# EAGLE design base_acacia (EAGLE 7.7.0)
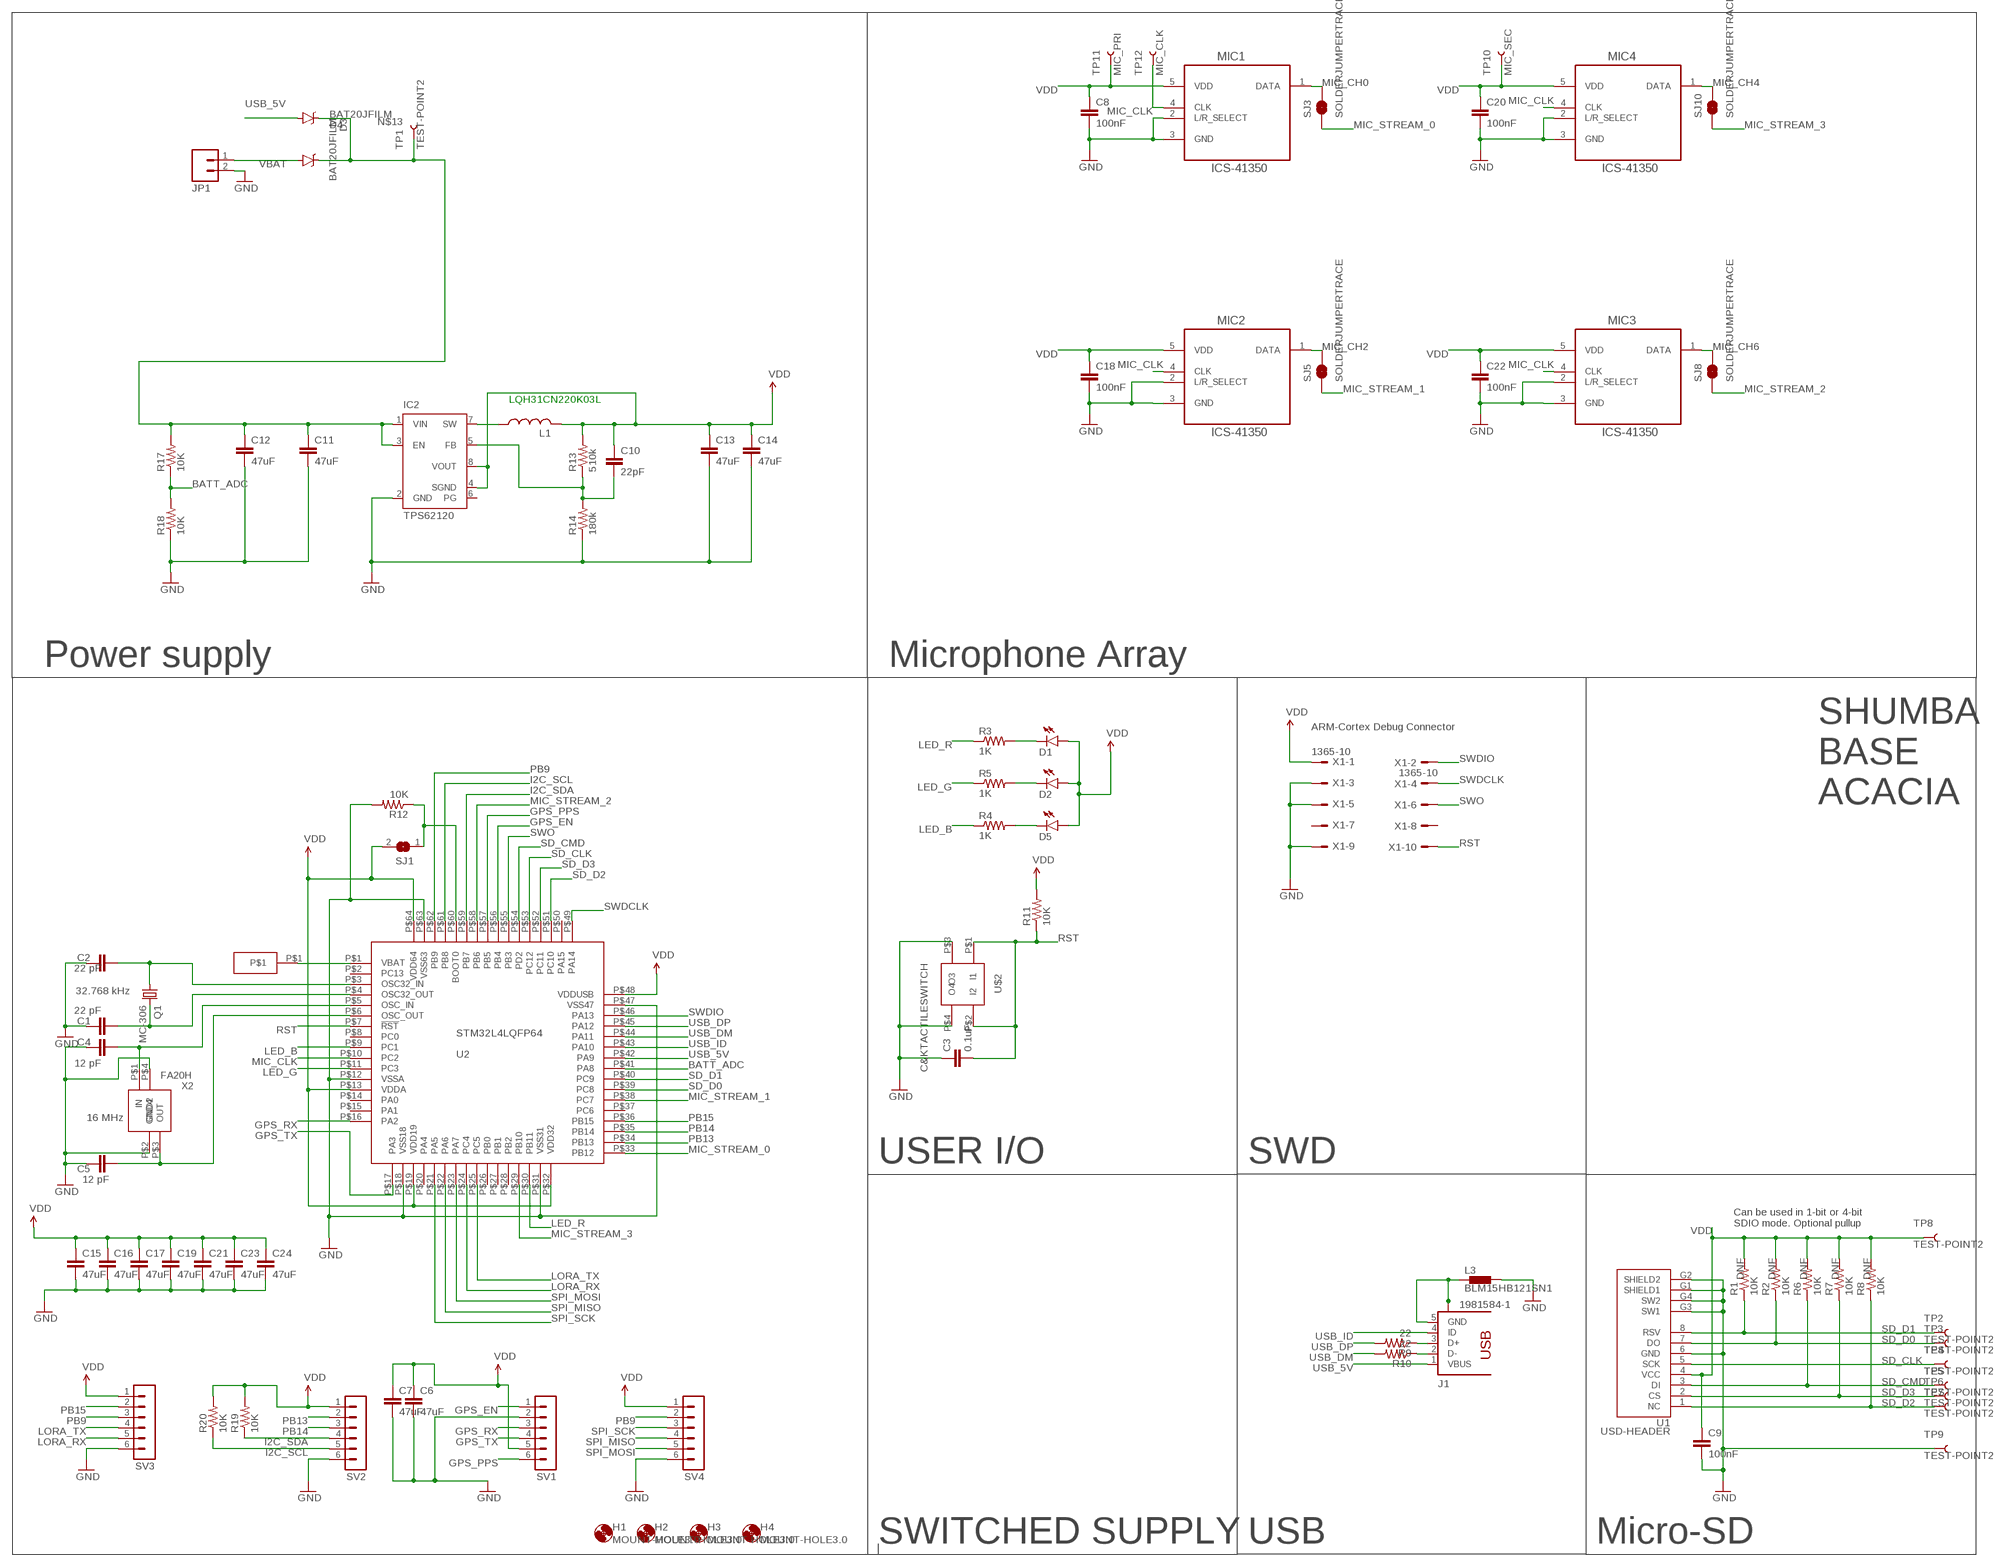
[diagram p0: schematic, sheet 1]

## Parts
C1  22 pF  CAP0603-CAP  [0603-CAP]
C2  22 pF  CAP0603-CAP  [0603-CAP]
C3  0.1uF  0.1UF-25V(+80/-20%)(0603)  [0603-CAP]
C4  12 pF  CAP0603-CAP  [0603-CAP]
C5  12 pF  CAP0603-CAP  [0603-CAP]
C6  47uF  CAP0603-CAP  [0603-CAP]
C7  47uF  CAP0603-CAP  [0603-CAP]
C8  100nF  CAP0603-CAP  [0603-CAP]
C9  100nF  CAP0603-CAP  [0603-CAP]
C10  22pF  CAP0603-CAP  [0603-CAP]
C11  47uF  CAP0603-CAP  [0603-CAP]
C12  47uF  CAP0603-CAP  [0603-CAP]
C13  47uF  CAP0603-CAP  [0603-CAP]
C14  47uF  CAP0603-CAP  [0603-CAP]
C15  47uF  CAP0603-CAP  [0603-CAP]
C16  47uF  CAP0603-CAP  [0603-CAP]
C17  47uF  CAP0603-CAP  [0603-CAP]
C18  100nF  CAP0603-CAP  [0603-CAP]
C19  47uF  CAP0603-CAP  [0603-CAP]
C20  100nF  CAP0603-CAP  [0603-CAP]
C21  47uF  CAP0603-CAP  [0603-CAP]
C22  100nF  CAP0603-CAP  [0603-CAP]
C23  47uF  CAP0603-CAP  [0603-CAP]
C24  47uF  CAP0603-CAP  [0603-CAP]
D1  LED0603  [LED-0603]
D2  LED0603  [LED-0603]
D3  BAT20JFILM  [SOD-323]
D4  BAT20JFILM  [SOD-323]
D5  LED0603  [LED-0603]
H1  MOUNT-HOLE3.0  [3,0]
H2  MOUNT-HOLE3.0  [3,0]
H3  MOUNT-HOLE3.0  [3,0]
H4  MOUNT-HOLE3.0  [3,0]
IC2  TPS62120  [DCN-R-PDSO-G8]
J1  1981584-1  [1981584-1]
JP1  M02PTH4  [1X02_XTRA_BIG]
L1  L-USL3216C  [L3216C]
L3  BLM15HB121SN1  [0402]
MIC1  ICS-41350  [ADI_ADMP521A]
MIC2  ICS-41350  [ADI_ADMP521A]
MIC3  ICS-41350  [ADI_ADMP521A]
MIC4  ICS-41350  [ADI_ADMP521A]
Q1  MC-306  [MC-306]
R1  10K  10KOHM-1/10W-1%(0603)0603  [0603-RES]
R2  10K  10KOHM-1/10W-1%(0603)0603  [0603-RES]
R3  1K  1KOHM-1/10W-1%(0603)  [0603-RES]
R4  1K  1KOHM-1/10W-1%(0603)  [0603-RES]
R5  1K  1KOHM-1/10W-1%(0603)  [0603-RES]
R6  10K  10KOHM-1/10W-1%(0603)0603  [0603-RES]
R7  10K  10KOHM-1/10W-1%(0603)0603  [0603-RES]
R8  10K  10KOHM-1/10W-1%(0603)0603  [0603-RES]
R9  22  10KOHM-1/10W-1%(0603)0603  [0603-RES]
R10  22  10KOHM-1/10W-1%(0603)0603  [0603-RES]
R11  10K  10KOHM-1/10W-1%(0603)0603  [0603-RES]
R12  10K  10KOHM-1/10W-1%(0603)0603  [0603-RES]
R13  510k  10KOHM-1/10W-1%(0603)0603  [0603-RES]
R14  180k  10KOHM-1/10W-1%(0603)0603  [0603-RES]
R17  10K  10KOHM-1/10W-1%(0603)0603  [0603-RES]
R18  10K  10KOHM-1/10W-1%(0603)0603  [0603-RES]
R19  10K  10KOHM-1/10W-1%(0603)0603  [0603-RES]
R20  10K  10KOHM-1/10W-1%(0603)0603  [0603-RES]
SJ1  SJ  [SJ]
SJ3  SOLDERJUMPERTRACE  [SJ_2S-TRACE]
SJ5  SOLDERJUMPERTRACE  [SJ_2S-TRACE]
SJ8  SOLDERJUMPERTRACE  [SJ_2S-TRACE]
SJ10  SOLDERJUMPERTRACE  [SJ_2S-TRACE]
SV1  MA06-1  [MA06-1]
SV2  MA06-1  [MA06-1]
SV3  MA06-1  [MA06-1]
SV4  MA06-1  [MA06-1]
TP1  TEST-POINT2  [PAD.02X.02]
TP2  TEST-POINT2  [PAD.02X.02]
TP3  TEST-POINT2  [PAD.02X.02]
TP4  TEST-POINT2  [PAD.02X.02]
TP5  TEST-POINT2  [PAD.02X.02]
TP6  TEST-POINT2  [PAD.02X.02]
TP7  TEST-POINT2  [PAD.02X.02]
TP8  TEST-POINT2  [PAD.02X.02]
TP9  TEST-POINT2  [PAD.02X.02]
TP10  MIC_SEC  TEST-POINT2  [PAD.02X.02]
TP11  MIC_PRI  TEST-POINT2  [PAD.02X.02]
TP12  MIC_CLK  TEST-POINT2  [PAD.02X.02]
U1  USD-HEADER  [USD-HEADER-1.1]
U2  STM32L4LQFP64  [STM32L4LQFP64]
U$2  C&KTACTILESWITCH  [C&KTACTILESWITCH]
U$7  SMDPAD  [SMDPAD]
X1  1365-10  [1365-10]
X2  FA20H  [FA-20H]

## Nets
BATT_ADC: R17.1 R18.2 U2.P$41(PA8)
GND: C1.1 C2.1 C3.1 C4.1 C5.1 C6.2 C7.2 C8.2 C9.2 C11.2 C12.2 C13.2 C14.2 C15.2 C16.2 C17.2 C18.2 C19.2 C20.2 C21.2 C22.2 C23.2 C24.2 IC2.2(GND) JP1.2 L3.2 MIC1.2(L/R_SELECT) MIC1.3(GND) MIC2.2(L/R_SELECT) MIC2.3(GND) MIC3.2(L/R_SELECT) MIC3.3(GND) MIC4.2(L/R_SELECT) MIC4.3(GND) R12.2 R14.1 R18.1 SV1.2 SV2.6 SV3.6 SV4.6 TP9.P$1 U1.6(GND) U1.G1(SHIELD1) U1.G2(SHIELD2) U1.G3(SW1) U1.G4(SW2) U2.P$12(VSSA) U2.P$18(VSS18) U2.P$31(VSS31) U2.P$47(VSS47) U2.P$63(VSS63) U$2.P$3(O3) U$2.P$4(O4) X1.3 X1.5 X1.9 X2.P$2(GND2) X2.P$4(GND4)
GPS_EN: SV1.1 U2.P$56(PB4)
GPS_PPS: SV1.6 U2.P$57(PB5)
GPS_RX: SV1.3 U2.P$16(PA2)
GPS_TX: SV1.4 U2.P$17(PA3)
I2C_SCL: R20.1 SV2.5 U2.P$61(PB8)
I2C_SDA: R19.1 SV2.4 U2.P$59(PB7)
LED_B: R4.1 U2.P$9(PC1)
LED_G: R5.1 U2.P$11(PC3)
LED_R: R3.1 U2.P$30(PB11)
LORA_RX: SV3.5 U2.P$24(PC4)
LORA_TX: SV3.4 U2.P$25(PC5)
MIC_CH0: MIC1.1(DATA) SJ3.2
MIC_CH2: MIC2.1(DATA) SJ5.2
MIC_CH4: MIC4.1(DATA) SJ10.2
MIC_CH6: MIC3.1(DATA) SJ8.2
MIC_CLK: MIC1.4(CLK) MIC2.4(CLK) MIC3.4(CLK) MIC4.4(CLK) TP12.P$1 U2.P$10(PC2)
MIC_STREAM_0: SJ3.1 U2.P$33(PB12)
MIC_STREAM_1: SJ5.1 U2.P$38(PC7)
MIC_STREAM_2: SJ8.1 U2.P$58(PB6)
MIC_STREAM_3: SJ10.1 U2.P$29(PB10)
N$1: C2.2 Q1.1 U2.P$3(OSC32_IN)
N$2: C1.2 Q1.4 U2.P$4(OSC32_OUT)
N$3: C4.2 U2.P$5(OSC_IN) X2.P$1(IN)
N$4: C5.2 U2.P$6(OSC_OUT) X2.P$3(OUT)
N$6: J1.3(D+) R9.1
N$7: R12.1 SJ1.1 U2.P$60(BOOT0)
N$8: J1.2(D-) R10.1
N$9: U2.P$1(VBAT) U$7.P$1
N$11: D1.C R3.2
N$12: D2.C R5.2
N$13 [power]: C11.1 C12.1 D3.C D4.C IC2.1(VIN) IC2.3(EN) R17.2 TP1.P$1
N$17: D5.C R4.2
N$18 [power]: IC2.7(SW) L1.1
N$21: C10.2 IC2.5(FB) R13.1 R14.2
PB9: SV3.3 SV4.2 U2.P$62(PB9)
PB13: SV2.2 U2.P$34(PB13)
PB14: SV2.3 U2.P$35(PB14)
PB15: SV3.2 U2.P$36(PB15)
RST: C3.2 R11.1 U2.P$7(!RST) U$2.P$1(I1) U$2.P$2(I2) X1.10
SD_CLK: TP4.P$1 U1.5(SCK) U2.P$53(PC12)
SD_CMD: R6.1 TP5.P$1 U1.3(DI) U2.P$54(PD2)
SD_D0: R2.1 TP3.P$1 U1.7(DO) U2.P$39(PC8)
SD_D1: R1.1 TP2.P$1 U1.8(RSV) U2.P$40(PC9)
SD_D2: R8.1 TP7.P$1 U1.1(NC) U2.P$51(PC10)
SD_D3: R7.1 TP6.P$1 U1.2(CS) U2.P$52(PC11)
SPI_MISO: SV4.4 U2.P$22(PA6)
SPI_MOSI: SV4.5 U2.P$23(PA7)
SPI_SCK: SV4.3 U2.P$21(PA5)
SWDCLK: U2.P$49(PA14) X1.4
SWDIO: U2.P$46(PA13) X1.2
SWO: U2.P$55(PB3) X1.6
USB_5V: D4.A J1.1(VBUS) U2.P$42(PA9)
USB_DM: R10.2 U2.P$44(PA11)
USB_DP: R9.2 U2.P$45(PA12)
USB_ID: J1.4(ID) U2.P$43(PA10)
USB_SHIELD: J1.5(GND) J1.S1 J1.S2 J1.S3 J1.S4 L3.1
VBAT [power]: D3.A JP1.1
VDD: C6.1 C7.1 C8.1 C9.1 C10.1 C13.1 C14.1 C15.1 C16.1 C17.1 C18.1 C19.1 C20.1 C21.1 C22.1 C23.1 C24.1 D1.A D2.A D5.A IC2.4(SGND) IC2.8(VOUT) L1.2 MIC1.5(VDD) MIC2.5(VDD) MIC3.5(VDD) MIC4.5(VDD) R1.2 R2.2 R6.2 R7.2 R8.2 R11.2 R13.2 R19.2 R20.2 SJ1.2 SV1.5 SV2.1 SV3.1 SV4.1 TP8.P$1 TP10.P$1 TP11.P$1 U1.4(VCC) U2.P$13(VDDA) U2.P$19(VDD19) U2.P$32(VDD32) U2.P$48(VDDUSB) U2.P$64(VDD64) X1.1
Unconnected: IC2.6(PG) U2.P$2(PC13) U2.P$8(PC0) U2.P$14(PA0) U2.P$15(PA1) U2.P$20(PA4) U2.P$26(PB0) U2.P$27(PB1) U2.P$28(PB2) U2.P$37(PC6) U2.P$50(PA15) X1.7 X1.8

## Notes on the sheet
- LQH31CN220K03L
- Power supply | Microphone Array
- ARM-Cortex Debug Connector
- SHUMBA
  BASE
  ACACIA
- 32.768 kHz
- 16 MHz
- USER I/O | SWD
- Can be used in 1-bit or 4-bit
  SDIO mode. Optional pullup
- SWITCHED SUPPLY | USB | Micro-SD

## Library data of the parts
C1 C2 C4 C5 = SparkFun-Capacitors:CAP: Capacitor Standard 0603 ceramic capacitor, and 0.1" leaded capacitor.
C3 = SparkFun-Capacitors:0.1UF-25V(+80/-20%)(0603): CAP-00810 Ceramic Standard decoupling cap; PROD_ID: CAP-00810
C6-C24 = SparkFun-Passives:CAP: Capacitor Standard 0603 ceramic capacitor, and 0.1" leaded capacitor.
D1 D2 D5 = SparkFun-LED:LED: LEDs Standard schematic elements and footprints for 5mm, 3mm, 1206, and 0603 sized LEDs. 5mm - Spark Fun Electronics SKU : COM-00529 (and others)
D3 D4 = SparkFun-DiscreteSemi:BAT20JFILM: 23V, 1A Schottky diode, SOD-323 package; PROD_ID: DIO-11623
H1-H4 = holes:MOUNT-HOLE: MOUNTING HOLE with drill center marker
IC2 = texas:TPS62120: 15V, 75mA High Efficient Buck Converter Source: tps62120.pdf (www.ti.com); OC_DIGIKEY: 296-27815-1-ND; OC_FARNELL: 2345836
J1 = con-usb:1981584-1: Receptacle, micro-USB, type A/B Tyco Electronics; MF: Hirose; MPN: ZX 62 B 5PA(33); OC_DIGIKEY: H125270CT-ND
JP1 = SparkFun-Connectors:M02: Standard 2-pin 0.1" header. Use with - straight break away headers ( PRT-00116) - right angle break away headers (PRT-00553) - swiss pins (PRT-00743) - machine pins (PRT-00117) - female headers (PRT-00115) Molex polarized connector foot print use with: PRT-08233 with associated crimp pins and housings. 2.54_SCREWTERM for use with PRT-10571. 3.5mm Screw Terminal footprints for PRT-08084 5mm Screw Terminal footprints for use with PRT-08432; OC_FARNELL: 9731148
L1 = rcl:L-US: INDUCTOR, American symbol
L3 = inductors:BLM15H: EMIFIL (R) Chip Ferrite Bead for GHz Noise Source: http://www.murata.com/ Ferrite Bead BLM15H.pdf
MIC1-MIC4 = MEMS_MIC:ICS-41350: Invense ICS-41350 PDM MIC LGA_CAV5 package
Q1 = crystal:MC-306: kHz RANGE CRYSTAL UNIT SMD Source: MC-306_405_406_E07X.PDF Homepage <http://www.epsontoyocom.co.jp>; MPN: MC-306 32.768KHZ 20PPM ,12.5PF; OC_FARNELL: 1216208
R1 R2 R6-R8 = SparkFun-Resistors:10KOHM-1/10W-1%(0603): RES-00824; DNF: DNF; PROD_ID: RES-00824
R3-R5 = SparkFun-Resistors:1KOHM-1/10W-1%(0603): RES-07856; PROD_ID: RES-07856
R9 R10 R13 R14 = SparkFun-Resistors:10KOHM-1/10W-1%(0603): RES-00824; PROD_ID: RES-00824; VALUE: 10K
R11 R12 R17-R20 = SparkFun-Resistors:10KOHM-1/10W-1%(0603): RES-00824; PROD_ID: RES-00824
SJ1 = jumper:SJ: SMD solder JUMPER
SJ3 SJ5 SJ8 SJ10 = SparkFun-Retired:SOLDERJUMPER: Solder Jumper Standard SMD solder jumper. Used to automate production. Two varients : Normally Open and Normally Closed are the same, but have different paste layers. NC will have a large amount of paste and should jumper during reflow.
SV1-SV4 = con-lstb:MA06-1: PIN HEADER; OC_FARNELL: unknown; OC_NEWARK: unknown
TP1-TP12 = SparkFun-Passives:TEST-POINT: Bare copper test points for troubleshooting or ICT
U1 = ACM:USD-HEADER: microSD Header MOLEX CONNECTOR, MICRO SD HEADER, 2.65MM Connector Type:Memory Card; Series:47309; No. of Contacts:8; Pitch Spacing 1.1 mm Farnell order code: 1568092 Comes in different heights
U2 = Kris:STM32L4LQFP64: LQFP64 Package for ST's STM32L476 32-bit low-power microcontroller
U$2 = Kris:C&KTACTILESWITCH: C&K Tactile Switch 611-PTS810SJS250SMTR
U$7 = Kris:SMDPAD: smd test pad
X1 = con-leotronics:1365-10: DUAL ROW STRAIGHT HEADER 1364 SERIES. 1.27mm x 1.27mm. Without Fixing Post. SMT Source: http://www.leotronics.co.uk/Conexcon/Data%20Sheets/sec.%20A/1364ing.pdf; OC_FARNELL: unknown; OC_NEWARK: unknown; SKU: SHF-105-01-L-D-SM
X2 = Kris:FA20H: Seiko Epson 2.5 mm x 2.0 mm FA-20H 16 MHz crystal; MPN: Q24FA20H00044 FA-20H 16 MHZ 9.0PF Crystal, 16 MHz, SMD; OC_DIGIKEY: SER4068CT-ND; OC_FARNELL: 1712814

## Net classes
0 default: width 0.254 mm, clearance 0.203 mm
1 power: width 0.254 mm, clearance 0.203 mm

## Board
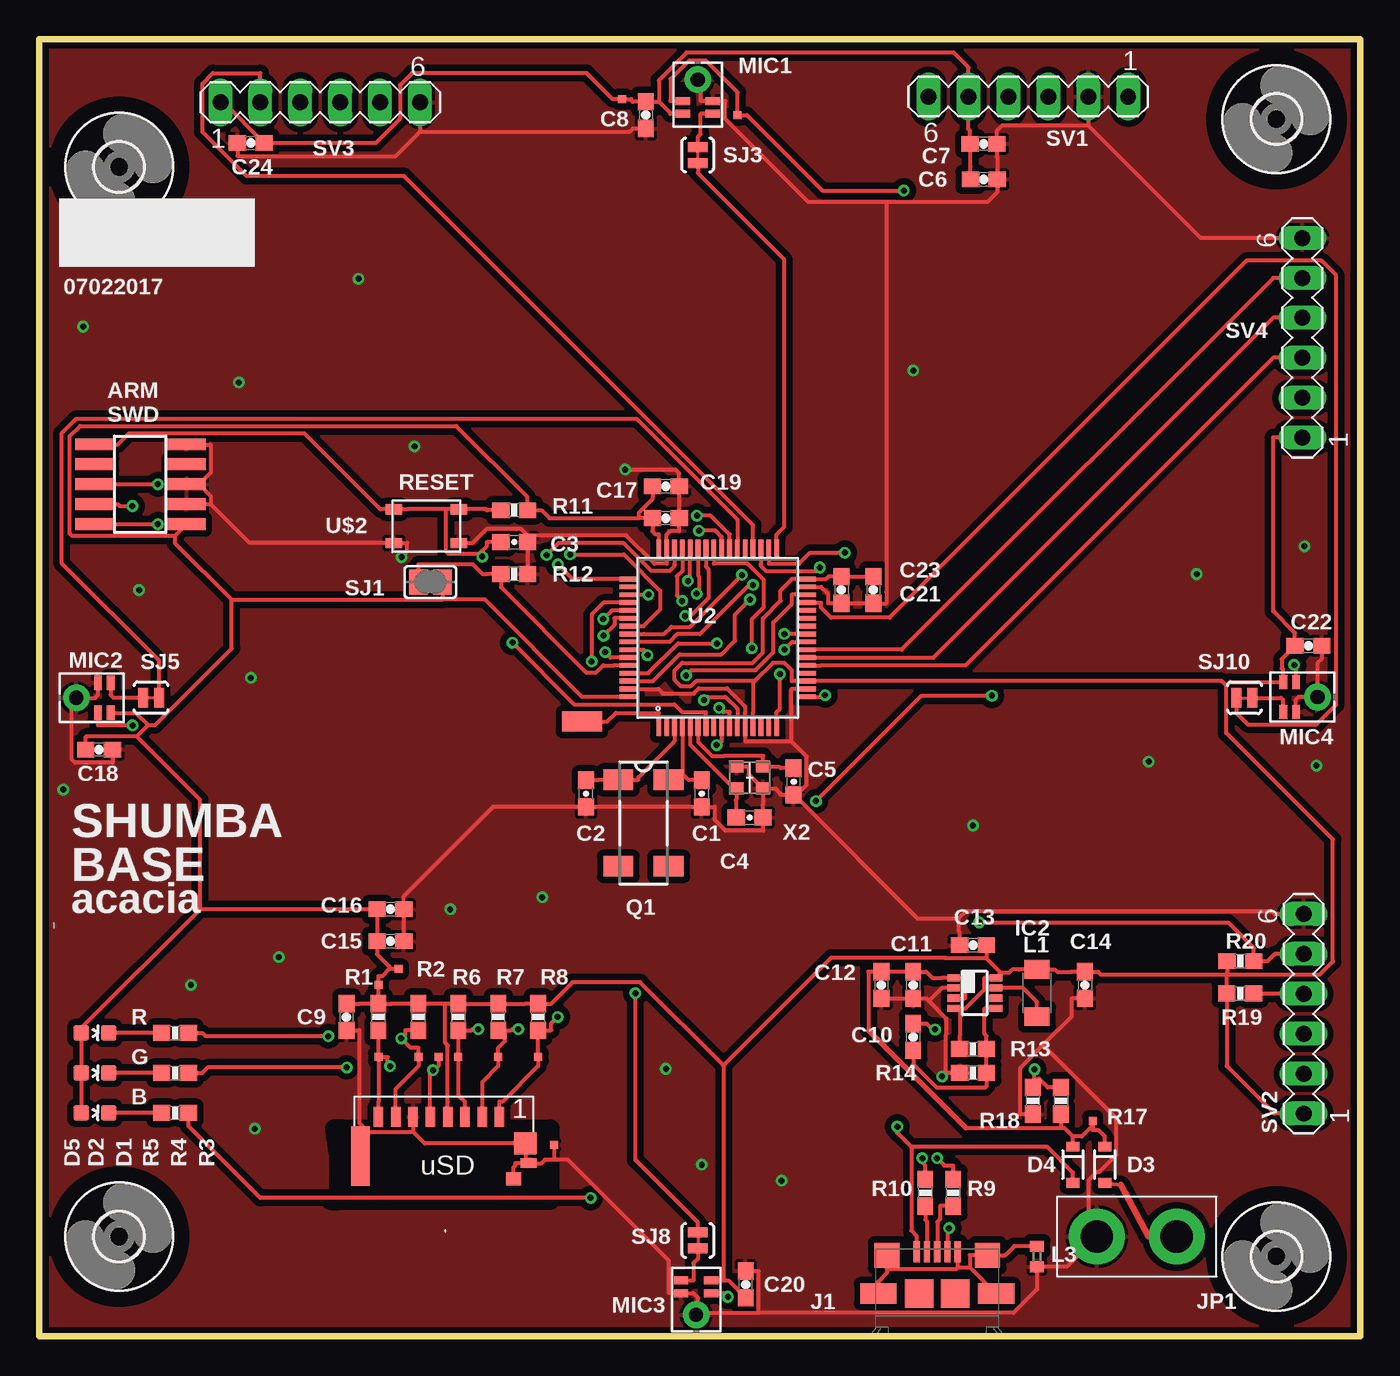
[diagram p1: board, top side]
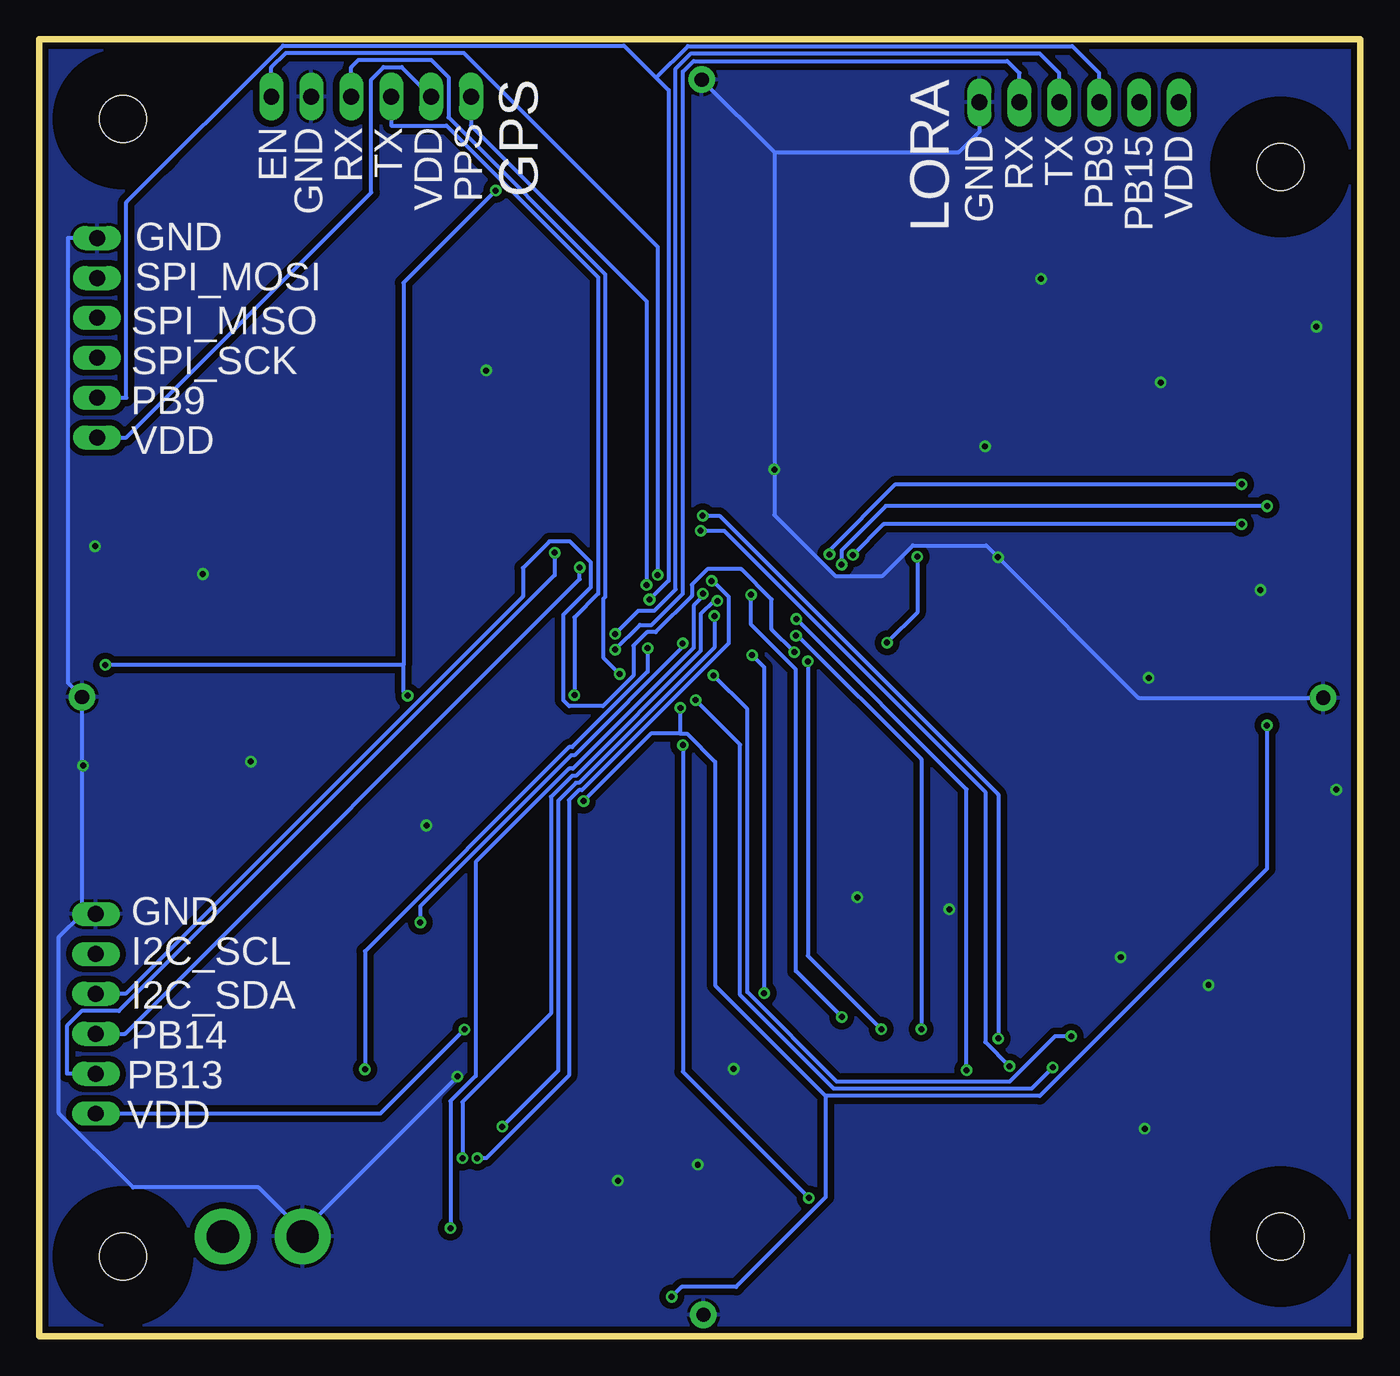
[diagram p2: board, bottom side, seen from below]

Size 84.07 x 82.55 mm. Coordinates in mm from the lower left corner, seen from the top.
Outline: 0,0 84.07,0 84.07,82.55 0,82.55 0,0
Copper layers (1*16): Top 0.018mm / dielectric 1.55mm / Bottom 0.018mm
Design rules "eC_2Layer_PClass6_BaseCopperO18_eCDefault": minimum track width 0.15mm, minimum drill 0.35mm, track to track 0.15mm, track to pad 0.15mm, pad to pad 0.15mm, via to via 0.15mm, smd to smd 0mil, copper to edge 0.25mm, drill to drill 0.35mm, minimum pad ring 0.175mm, minimum via ring 0.125mm, stop-mask expansion 0mil, vias tented up to drill 0.45mm, thermal gap 0.2mm
tRestrict: area 18.5,8.6 to 32.5,13.2

### Footprints (pad centres in the part's own frame; a part is rotated, then mirrored left to right if it is on the bottom)
0603-CAP = smd 1.1 x 1: 1 -0.85,0; 2 0.85,0
LED-0603 = smd 1 x 1: A 0,-0.877; C 0,0.877
SOD-323 = smd 0.63 x 0.83: A 1.15,0; C -1.15,0
3,0 = hole 3: 0,0
DCN-R-PDSO-G8 = smd 0.45 x 0.8: 1 -0.975,-1.35; 2 -0.325,-1.35; 3 0.325,-1.35; 4 0.975,-1.35; 5 0.975,1.35; 6 0.325,1.35; 7 -0.325,1.35; 8 -0.975,1.35
1981584-1 = smd 0.4 x 1.35: 1 -1.3,4.1; 2 -0.65,4.1; 3 0,4.1; 4 0.65,4.1; 5 1.3,4.1 | smd 1.8 x 1.8: M1 -1.15,1.45; M2 1.15,1.45 | smd 2.3 x 1.3: S1 -3.75,1.45; S2 3.75,1.45 | smd 1.6 x 1.6: S3 -3.2,3.885; S4 3.2,3.885
1X02_XTRA_BIG = drill 2.057 pad 3.556: 1 -2.54,0; 2 2.54,0
L3216C = smd 1.2 x 1.6: 1 -1.5,0; 2 1.5,0
0402 = smd 0.7 x 0.9: 1 -0.65,0; 2 0.65,0
ADI_ADMP521A = smd 0.5 x 0.9: 1 1.218,0.957; 2 0.406,0.957; 4 0.406,-0.957; 5 1.218,-0.957 | drill 0.9 pad 1.7: 3 -0.965,0
MC-306 = smd 1.3 x 1.9: 1 -2.75,-1.6; 2 2.75,-1.6; 3 2.75,1.6; 4 -2.75,1.6
0603-RES = smd 1.1 x 1: 1 -0.85,0; 2 0.85,0
SJ = smd 1.168 x 1.6: 1 -0.762,0; 2 0.762,0
SJ_2S-TRACE = smd 0.635 x 1.27: 1 -0.508,0; 2 0.508,0
MA06-1 = drill 1.016 long: 1 -6.35,0; 2 -3.81,0; 3 -1.27,0; 4 1.27,0; 5 3.81,0; 6 6.35,0
PAD.02X.02 = smd 0.508 x 0.508: P$1 0,0
USD-HEADER-1.1 = smd 0.6 x 1.25: 1 7.7,0; 2 6.6,0; 3 5.5,0; 4 4.4,0; 5 3.3,0; 6 2.2,0; 7 1.1,0; 8 0,0 | smd 1.2 x 3.8: G1 -1.15,-2.5 | smd 1.45 x 1.4: G2 9.35,-1.7 | smd 1 x 0.6: G3 9.55,-2.95 | smd 0.95 x 0.85: G4 8.6,-3.95
STM32L4LQFP64 = smd 0.3 x 1.2: P$1 -3.75,-5.65; P$2 -3.25,-5.65; P$3 -2.75,-5.65; P$4 -2.25,-5.65; P$5 -1.75,-5.65; P$6 -1.25,-5.65; P$7 -0.75,-5.65; P$8 -0.25,-5.65; P$9 0.25,-5.65; P$10 0.75,-5.65; P$11 1.25,-5.65; P$12 1.75,-5.65; P$13 2.25,-5.65; P$14 2.75,-5.65; P$15 3.25,-5.65; P$16 3.75,-5.65; P$33 3.75,5.65; P$34 3.25,5.65; P$35 2.75,5.65; P$36 2.25,5.65; P$37 1.75,5.65; P$38 1.25,5.65; P$39 0.75,5.65; P$40 0.25,5.65; P$41 -0.25,5.65; P$42 -0.75,5.65; P$43 -1.25,5.65; P$44 -1.75,5.65; P$45 -2.25,5.65; P$46 -2.75,5.65; P$47 -3.25,5.65; P$48 -3.75,5.65 | smd 1.2 x 0.3: P$17 5.65,-3.75; P$18 5.65,-3.25; P$19 5.65,-2.75; P$20 5.65,-2.25; P$21 5.65,-1.75; P$22 5.65,-1.25; P$23 5.65,-0.75; P$24 5.65,-0.25; P$25 5.65,0.25; P$26 5.65,0.75; P$27 5.65,1.25; P$28 5.65,1.75; P$29 5.65,2.25; P$30 5.65,2.75; P$31 5.65,3.25; P$32 5.65,3.75; P$49 -5.65,3.75; P$50 -5.65,3.25; P$51 -5.65,2.75; P$52 -5.65,2.25; P$53 -5.65,1.75; P$54 -5.65,1.25; P$55 -5.65,0.75; P$56 -5.65,0.25; P$57 -5.65,-0.25; P$58 -5.65,-0.75; P$59 -5.65,-1.25; P$60 -5.65,-1.75; P$61 -5.65,-2.25; P$62 -5.65,-2.75; P$63 -5.65,-3.25; P$64 -5.65,-3.75
C&KTACTILESWITCH = smd 1.05 x 0.65: P$1 -2.075,1.073; P$2 2.075,1.075; P$3 -2.075,-1.075; P$4 2.075,-1.075
SMDPAD = smd 1.27 x 2.54: P$1 0,0
1365-10 = smd 0.76 x 2.4: 1 -2.54,-2.95; 2 -2.54,2.95; 3 -1.27,-2.95; 4 -1.27,2.95; 5 0,-2.95; 6 0,2.95; 7 1.27,-2.95; 8 1.27,2.95; 9 2.54,-2.95; 10 2.54,2.95
FA-20H = smd 0.9 x 0.75: P$1 -0.85,-0.7; P$2 0.85,-0.7; P$3 0.85,0.7; P$4 -0.85,0.7

### Placement (x,y rotation side)
C1  42.16,34.54 90 top
C2  34.8,34.54 90 top
C3  30.23,50.55 180 top
C4  45.21,33.02 180 top
C5  48.01,35.31 90 top
C6  60.12,73.63 0 top
C7  60.1,75.9 0 top
C8  38.61,77.72 270 top
C9  19.56,20.32 270 top
C10  55.63,19.05 270 top
C11  55.63,22.35 270 top
C12  53.59,22.35 270 top
C13  59.44,24.89 180 top
C14  66.55,22.35 270 top
C15  22.35,25.15 0 top
C16  22.35,27.18 0 top
C17  39.88,52.07 0 top
C18  3.81,37.34 0 top
C19  39.88,54.1 0 top
C20  44.96,3.3 90 top
C21  51.05,47.5 270 top
C22  80.77,43.94 0 top
C23  53.09,47.5 270 top
C24  13.46,75.95 180 top
D1  3.56,19.3 270 top
D2  3.56,16.76 270 top
D3  67.82,10.92 270 top
D4  65.79,10.92 270 top
D5  3.56,14.22 270 top
H1  5.08,6.35 0 top
H2  78.74,77.47 0 top
H3  5.08,74.42 0 top
H4  78.74,5.08 0 top
IC2  59.54,21.84 270 top
J1  57.15,1.27 0 top
JP1  69.85,6.35 180 top
L1  63.5,21.84 90 top
L3  63.5,5.08 270 top
MIC1  41.91,79.02 270 top
MIC2  3.33,40.64 0 top
MIC3  41.81,2.34 90 top
MIC4  80.39,40.69 180 top
Q1  38.46,32.66 270 top
R1  21.59,20.32 90 top
R2  24.13,20.32 90 top
R3  8.64,19.3 180 top
R4  8.64,14.22 180 top
R5  8.64,16.76 180 top
R6  26.67,20.32 90 top
R7  29.21,20.32 90 top
R8  31.75,20.32 90 top
R9  58.17,9.14 90 top
R10  56.39,9.14 90 top
R11  30.23,52.58 0 top
R12  30.23,48.51 0 top
R13  59.44,18.29 180 top
R14  59.44,16.76 0 top
R17  65.02,14.99 270 top
R18  63.25,14.99 90 top
R19  76.43,21.82 180 top
R20  76.45,23.88 180 top
SJ1  24.89,48.01 0 top
SJ3  41.91,75.18 90 top
SJ5  7.11,40.64 180 top
SJ8  41.91,6.1 270 top
SJ10  76.71,40.64 0 top
SV1  62.95,78.91 180 top
SV2  80.47,20.52 90 top
SV3  17.88,78.54 0 top
SV4  80.39,63.55 90 top
TP1  67.06,13.72 270 top
TP2  21.59,17.78 0 top
TP3  24.13,17.78 0 top
TP4  25.4,17.78 0 top
TP5  26.67,17.78 0 top
TP6  29.21,17.78 0 top
TP7  31.75,17.78 0 top
TP8  21.59,22.35 0 top
TP9  32.77,12.19 0 top
TP10  22.86,23.37 0 top
TP11  37.08,78.74 0 top
TP12  44.45,77.72 0 top
U1  21.59,13.97 0 top
U2  43.18,44.45 0 top
U$2  24.64,51.56 0 top
U$7  34.54,39.12 270 top
X1  6.43,54.23 90 top
X2  45.21,35.56 0 top

### Tracks (layer width: path | path; a pad name or v marks a point on that pad's centre or on a via)
BATT_ADC  (via drill 0.38 pad 0.74)
  Top 0.254: v45.35,43.79 45.35,45.64 46.12,46.41 46.12,48.12 45.07,49.17 42.93,49.17 U2.P$41 | 63.34,16.39 v63.34,16.99 | 63.34,16.39 63.65,16.39 64.19,15.84 R17.1 | R18.2 63.25,16.29 63.34,16.39
  Bottom 0.254: v45.35,43.79 45.35,42.3 50.15,37.5 50.34,37.5 63.34,24.51 v63.34,16.99
GND  (via drill 0.38 pad 0.74)
  Top 0.254: 57.71,16.76 57.71,19.22 57.75,19.26 57.75,20.21 56.62,21.34 | v57.46,16.54 57.48,16.54 57.71,16.76 | 56.62,21.34 56.46,21.5 C11.2 C12.2 | 56.62,21.34 57.46,22.17 IC2.2 | R14.1 57.71,16.76 | v23.05,49.59 23.42,49.95 23.42,50.49 U$2.P$3 13.38,50.49 10.91,52.96 | U2.P$63 39.41,41.2 39.7,40.91 41.64,40.91 41.97,41.24 43.79,41.24 44.93,40.09 44.93,39.73 U2.P$12 44.93,37.87 47.87,37.87 | U2.P$31 49.76,47.7 50.22,47.24 50.22,46.65 C21.2 C23.2 53.92,46.65 53.92,72.19 | 48.19,34.46 48.84,35.1 48.84,36.9 47.87,37.87 | 47.87,37.87 47.87,41.17 47.9,41.2 U2.P$18 | 48.19,34.46 48.19,34.31 55.91,26.59 58.51,26.59 | 58.51,26.59 58.51,25.79 58.59,25.72 C13.2 | 58.51,26.59 58.97,27.05 78.43,27.05 78.61,26.87 SV2.6 | 48.19,34.46 C5.1 47.7,34.46 47.18,34.46 47.18,34.53 46.84,34.86 X2.P$2 | 32.77,11.24 33.64,11.24 40.07,4.81 40.07,2.74 MIC3.2 41.63,2.74 41.93,2.45 41.93,1.49 | MIC4.2 79.98,40.51 80.16,40.69 MIC4.3 81.36,42.85 81.62,43.11 C22.2 | v37.3,55.17 40.49,55.17 40.73,54.93 C19.2 40.73,53.69 C17.2 40.73,51.24 40.14,51.24 39.93,51.03 U2.P$47 39.93,49.17 39.14,49.17 37.35,50.97 31.08,50.97 | 32.77,11.24 32.19,11.24 31.97,11.02 31.55,11.02 | 32.77,11.24 32.77,11.9 TP9.P$1 | U1.G4 30.19,10.78 30.31,10.89 30.31,11.02 U1.G3 31.55,11.02 | 31.55,11.02 31.34,11.24 30.94,11.24 U1.G2 30.73,12.27 24.54,12.27 23.79,13.02 | C24.2 12.61,75.12 22.66,75.12 24.23,76.68 | C8.2 37.78,76.87 37.59,76.68 24.23,76.68 | SV3.6 24.23,76.68 | 20.93,13.02 20.39,13.56 20.39,19.47 C9.2 | 20.93,13.02 20.93,12.85 20.44,12.36 U1.G1 | 20.93,13.02 23.79,13.02 | U1.6 23.79,13.02 | X2.P$2 46.06,33.85 46.06,33.18 46.06,33.1 46.06,33.06 C4.1 46.06,32.19 43.67,32.19 42.99,32.86 42.99,33.69 C1.1 C2.1 28.89,33.69 23.2,28.01 C16.2 C15.2
  Top 0.254: 45.14,36.26 | 45.14,36.26 45.14,35.78 X2.P$2 | 41.93,1.49 45.79,1.49 | MIC2.2 3.73,40.82 3.56,40.64 MIC2.3 2.08,40.36 2.08,36.7 2.27,36.51 4.66,36.51 C18.2 | 53.92,72.19 48.95,72.19 43.65,77.49 43.65,78.61 MIC1.2 42.09,78.61 42.09,79.81 MIC1.3 | 53.92,72.19 60.35,72.19 60.97,72.8 C6.2 60.97,75.04 60.95,75.06 C7.2 60.95,76.72 61.27,77.05 66.76,77.05 | 41.93,1.49 MIC3.3 | 45.79,1.49 62.01,1.49 63.5,2.98 L3.2 65.39,4.43 66.8,5.84 | 45.79,1.49 45.79,4.15 C20.2 | X2.P$4 44.48,36.26 45.14,36.26 | 31.08,50.97 30.66,51.38 28.46,51.38 27.57,50.49 U$2.P$4 | 31.08,50.97 C3.1 R12.2 | 63.89,18.54 62.42,17.07 62.42,14.14 R18.1 | 63.89,18.54 65.72,20.37 65.72,21.5 C14.2 | 66.8,5.84 66.8,9.95 67.3,10.45 67.46,10.45 68.57,11.56 68.57,13.86 63.89,18.54 | JP1.2 66.8,5.84 | 10.17,54.23 10.91,53.49 10.91,52.96 | SV4.6 73.91,69.9 66.76,77.05 | SV1.2 66.76,77.05 | X1.9 10.91,56.77 10.91,54.97 10.17,54.23 | 10.17,54.23 10.14,54.23 X1.5 | X1.3 10.91,52.96
  Bottom 0.254: SV4.6 82.25,69.9 82.25,41.58 MIC4.3 81.36,26.87 | 67.33,6.68 v57.46,16.54 | 67.33,6.68 70.13,9.48 78.11,9.48 82.82,14.19 82.82,25.41 81.36,26.87 | JP1.2 67.33,6.37 67.33,6.68 | MIC2.3 14.11,40.64 v23.05,49.59 23.8,50.33 28.47,50.33 30.4,48.4 33.41,48.4 37.3,52.28 v37.3,55.17 37.3,75.37 | SV2.6 81.36,26.87 | 37.3,75.37 MIC1.3 | 37.3,75.37 25.55,75.37 24.23,76.68 SV3.6
  other vias: 20.32,67.31 55.63,61.47 13.46,41.91 1.52,34.8 32,27.94 6.35,47.5 73.66,48.51 80.52,50.29 59.44,32.51 70.61,36.58 81.28,36.32 47.24,9.91 42.16,10.92 39.88,17.02 13.72,13.21 9.65,22.35 15.24,24.13 26.16,27.18 23.88,56.64 2.79,64.26 12.7,60.71
  pour Bottom (isolate 0.406): 0,82.55 83.82,82.55 83.82,0 0,0
  pour Top (isolate 0.406): 0,82.55 83.82,82.55 83.82,0 0,0
GPS_EN  (via drill 0.38 pad 0.74)
  Top 0.254: v44.72,48.45 41.41,45.15 40.23,45.15 39.78,44.7 38.46,44.7 U2.P$56
  Bottom 0.254: v44.72,48.45 44.72,69.35 57.06,81.69 68.37,81.69 69.3,80.76 SV1.1
GPS_PPS  (via drill 0.38 pad 0.74)
  Top 0.254: v45.42,47.83 45.18,47.83 42.05,44.69 40.6,44.69 40.11,44.2 U2.P$57
  Bottom 0.254: v45.42,47.83 45.42,65.88 56.6,77.05 SV1.6
GPS_RX  (via drill 0.38 pad 0.74)
  Top 0.254: v47.13,42.15 47.13,39.93 46.93,39.73 U2.P$16
  Bottom 0.254: v47.13,42.15 48.18,43.2 48.18,46.94 48.05,47.07 48.05,67.6 58.03,77.58 58.03,80.14 59.12,81.23 63.75,81.23 64.22,80.76 SV1.3
GPS_TX  (via drill 0.38 pad 0.74)
  Top 0.254: U2.P$17 49.91,40.7 v50.02,40.81
  Bottom 0.254: v50.02,40.81 50.02,45.75 48.51,47.26 48.51,67.41 58.16,77.05 61.68,77.05 SV1.4
I2C_SCL  (via drill 0.38 pad 0.74)
  Top 0.254: v59.83,26.34 75.67,26.34 77.3,24.71 R20.1 77.74,23.88 78.18,23.88 78.61,24.3 78.61,24.33 SV2.5 | U2.P$61 38.76,42.2 40.66,44.1 v43.13,44.1
  Bottom 0.254: v43.13,44.1 43.13,43.86 50.01,36.98 50.22,36.98 59.83,27.37 v59.83,26.34
I2C_SDA  (via drill 0.38 pad 0.74)
  Top 0.254: U2.P$59 36.35,43.2 v36.02,43.54 | R19.1 78.16,21.82 78.18,21.79 SV2.4
  Bottom 0.254: v36.02,43.54 37.46,44.99 37.46,46.9 39.38,48.82 41.55,48.82 42.54,47.83 42.54,47.12 44.84,44.82 45.39,44.82 46.26,43.95 46.26,42.04 48.2,40.1 50.34,40.1 50.72,40.48 50.72,45.92 48.97,47.68 48.97,49.25 50.3,50.59 51.6,50.59 53.29,48.91 53.29,47.09 78.58,21.79 SV2.4
LED_B  (via drill 0.38 pad 0.74)
  Top 0.254: U2.P$9 43.43,37.87 43.36,37.87 v43.11,37.63 | R4.1 9.49,13.39 14.07,8.81 v35.09,8.81
  Bottom 0.254: v43.11,37.63 43.11,16.83 v35.09,8.81
LED_G  (via drill 0.38 pad 0.74)
  Top 0.254: v42.3,40.49 42.51,40.7 43.67,40.7 44.43,39.95 U2.P$11 | R5.1 10.37,16.76 10.71,17.11 v19.57,17.11
  Bottom 0.254: v19.57,17.11 20.93,15.75 33.5,15.75 39.47,21.72 39.47,37.66 v42.3,40.49
LED_R  (via drill 0.38 pad 0.74)
  Top 0.254: v41.17,42.07 41.5,42.4 45.59,42.4 46.73,43.54 46.73,45.44 47.9,46.61 47.9,47.2 U2.P$30 | R3.1 10.37,19.3 10.57,19.09 v18.4,19.09
  Bottom 0.254: v18.4,19.09 19.43,19.09 22.32,16.21 33.31,16.21 39.01,21.91 39.01,39.91 v41.17,42.07
LORA_RX  (via drill 0.38 pad 0.74)
  Top 0.254: v47.42,43.7 47.92,44.2 U2.P$24
  Bottom 0.254: v47.42,43.7 45.85,45.28 45.1,45.28 43.11,47.27 43.11,80.49 42.43,81.17 22.46,81.17 21.69,80.39 SV3.5
LORA_TX  (via drill 0.38 pad 0.74)
  Top 0.254: U2.P$25 v47.42,44.7
  Bottom 0.254: v47.42,44.7 45.94,46.19 44.92,46.19 43.56,47.54 43.56,80.68 42.59,81.66 20.42,81.66 19.15,80.39 SV3.4
MIC_CH0
  Top 0.254: MIC1.1 42.09,77.8 42.09,76.52 41.91,76.34 SJ3.2
MIC_CH2
  Top 0.254: MIC2.1 4.54,40.82 4.72,40.64 SJ5.2
MIC_CH4
  Top 0.254: MIC4.1 79.17,40.51 79.05,40.64 SJ10.2
MIC_CH6
  Top 0.254: MIC3.1 41.63,3.55 41.63,4.66 41.91,4.94 SJ8.2
MIC_CLK  (via drill 0.38 pad 0.74)
  Top 0.254: v43.27,39.99 43.53,39.73 43.93,39.73 U2.P$10 | v49.43,34.06 56.15,40.78 v60.63,40.78 | MIC3.4 43.55,2.74 43.77,2.51 v43.83,2.51 | MIC2.4 3.73,38.9 3.75,38.89 v5.94,38.89 | v55.03,72.92 49.84,72.92 45.03,77.72 TP12.P$1 44.45,79.17 42.42,81.2 41.36,81.2 40.17,80.01 40.17,78.61 MIC1.4 | v79.87,42.73 79.98,42.61 MIC4.4
  Bottom 0.254: 43.27,38.35 45.14,38.35 v49.43,34.06 | 34.02,15.29 34.02,8.85 39.73,3.15 43.2,3.15 v43.83,2.51 | 43.27,38.35 42.85,38.35 41.06,36.56 41.06,22.33 34.02,15.29 | v5.94,38.89 5.94,29.75 20.4,15.29 34.02,15.29 | 43.27,38.35 v43.27,39.99 | 60.9,42.73 v79.87,42.73 | v55.03,72.92 60.9,67.05 60.9,42.73 | v60.63,40.78 60.9,41.05 60.9,42.73
MIC_STREAM_0
  Top 0.254: SJ3.1 41.91,74.03 47.42,68.52 47.42,51.52 46.93,51.03 U2.P$33
MIC_STREAM_1
  Top 0.254: SJ5.1 7.62,43.01 1.45,49.19 1.45,57.49 2.36,58.4 38.01,58.4 44.43,51.98 U2.P$38
MIC_STREAM_2  (via drill 0.38 pad 0.74)
  Top 0.254: v37.94,21.83 37.94,11.22 41.91,7.25 SJ8.1 | U2.P$58 38.46,43.7 38.46,43.6 v38.7,43.35
  Bottom 0.254: v38.7,43.35 37.94,42.59 v37.94,21.83
MIC_STREAM_3
  Top 0.254: SJ10.1 76.2,39.67 76.93,38.94 81.28,38.94 82.54,40.2 82.54,67.53 81.61,68.46 76.83,68.46 54.11,45.74 50.4,45.74 49.76,46.38 49.76,46.7 U2.P$29
N$1
  Top 0.254: C2.2 35.55,35.39 35.58,35.41 Q1.1 38.14,35.41 38.14,35.58 40.43,37.87 U2.P$3
N$2
  Top 0.254: 40.93,35.8 41.33,35.39 C1.2 | U2.P$4 40.93,35.8 | Q1.4 40.55,35.41 40.93,35.8
N$3
  Top 0.254: U2.P$5 41.43,37.65 44.36,34.72 44.36,34.51 | 44.36,34.51 44.36,34.16 44.33,34.12 44.33,33.02 C4.2 | X2.P$1 44.36,34.51
N$4
  Top 0.254: U2.P$6 41.93,37.87 41.93,37.82 42.83,36.93 43.56,36.93 43.59,36.97 46.06,36.97 X2.P$3 47.07,36.26 47.18,36.16 C5.2
N$6
  Top 0.254: R9.1 57.34,8.29 57.34,7.46 57.15,7.28 J1.3
N$7
  Top 0.254: 35.89,42.7 35.45,42.25 34.81,42.25 29.38,47.68 R12.1 28.5,48.51 28.21,48.51 27.59,49.14 24.13,49.14 SJ1.1 | 35.89,42.7 | 35.89,42.7 36.6,42.7 U2.P$60
N$8
  Top 0.254: R10.1 56.39,7.41 56.5,7.3 J1.2
N$9
  Top 0.254: U2.P$1 39.43,39.68 36.71,39.68 36.14,39.12 U$7.P$1
N$11
  Top 0.254: R3.2 D1.C
N$12
  Top 0.254: R5.2 D2.C
N$13
  Top 0.254: 52.76,19.46 52.76,23.2 C12.1 C11.1 56.46,23.2 56.84,22.82 57.46,22.82 IC2.1 58.92,22.82 58.92,21.52 IC2.3 | 58.97,13.26 65.02,13.26 | R17.2 65.02,13.26 | 65.02,13.26 65.25,13.26 65.79,12.72 | D4.C 65.79,12.72 | 67.06,13.42 66.35,12.72 65.79,12.72 | 67.06,13.42 67.06,13.13 67.4,13.13 67.82,12.72 D3.C | TP1.P$1 67.06,13.42
  Top 0.305: 52.76,19.46 58.97,13.26
N$17
  Top 0.254: R4.2 D5.C
N$18
  Top 0.254: L1.1 63.5,21.27 62.6,22.17 IC2.7
N$21
  Top 0.254: IC2.5 60.16,20.87 60.16,19.25 60.29,19.12 R13.1 R14.2 60.29,15.93 60.19,15.84 57.1,15.84 55.63,17.32 C10.2
PB9  (via drill 0.38 pad 0.74)
  Top 0.254: U2.P$62 39.05,41.7 40.75,43.4 43.42,43.4 44.29,44.27 44.29,45.95 v45.23,46.89
  Bottom 0.254: 44.81,80.1 44.02,79.31 44.02,48.1 v45.23,46.89 | 44.81,80.1 42.79,82.11 18.33,82.11 16.61,80.39 SV3.3 | 44.81,80.1 46.86,82.15 68.56,82.15 78.54,72.17 78.54,59.74 SV4.2
PB13  (via drill 0.38 pad 0.74)
  Top 0.254: v51.28,49.87 49.06,49.87 48.36,49.17 46.43,49.17 U2.P$34
  Bottom 0.254: SV2.2 82.32,16.71 82.32,19.75 81.37,20.7 79.02,20.7 51.28,48.44 v51.28,49.87
PB14  (via drill 0.38 pad 0.74)
  Top 0.254: v49.67,48.93 49.46,48.71 46.24,48.71 45.93,49.02 45.93,49.17 U2.P$35
  Bottom 0.254: v49.67,48.93 49.67,48.19 78.61,19.25 SV2.3
PB15
  Top 0.254: SV3.2 14.07,80.39 11.05,80.39 10.39,79.73 10.39,76.64 13.19,73.84 23.22,73.84 45.43,51.63 U2.P$36
RST  (via drill 0.38 pad 0.74)
  Top 0.254: U2.P$7 42.43,39.73 40.91,39.73 40.42,40.22 34.04,40.22 v30.11,44.15 | 28,49.81 v28.2,49.62 | 28,49.81 28.5,50.31 28.5,50.55 C3.2 | 25.86,52.64 25.86,49.98 26.02,49.81 28,49.81 | 25.86,52.64 23.42,52.64 23.42,52.63 U$2.P$1 21.71,52.63 16.86,57.48 5.72,57.48 5.01,56.77 X1.10 | 25.86,52.64 U$2.P$2 28.44,52.64 28.5,52.58 R11.1
  Bottom 0.254: v28.2,49.62 28.2,46.06 v30.11,44.15
SD_CLK  (via drill 0.38 pad 0.74)
  Top 0.254: U2.P$53 36.44,46.2 v35.89,45.65 | U1.5 24.89,16.77 v25.06,16.94 25.14,16.94 25.4,17.2 TP4.P$1
  Bottom 0.254: v25.06,16.94 25.06,34.82 v35.89,45.65
SD_CMD  (via drill 0.38 pad 0.74)
  Top 0.254: U2.P$54 36.6,45.7 36.6,45.28 v35.91,44.59 | v27.94,19.54 27.57,19.54 27.5,19.47 R6.1 TP5.P$1 26.67,15.35 27.09,14.93 U1.3
  Bottom 0.254: v35.91,44.59 35.8,44.59 27.94,36.73 v27.94,19.54
SD_D0  (via drill 0.38 pad 0.74)
  Top 0.254: v41.85,52.22 42.74,52.22 43.93,51.03 U2.P$39 | R2.1 23.3,19.47 23.3,19.21 v23.04,18.95 23.62,18.36 24.13,18.36 TP3.P$1 24.13,17.59 24.13,17.2 22.69,15.76 U1.7
  Bottom 0.254: v41.85,52.22 40.78,52.22 23.04,34.48 v23.04,18.95
SD_D1  (via drill 0.38 pad 0.74)
  Top 0.254: TP2.P$1 22.17,17.78 22.17,17.34 v22.32,17.19 | U2.P$40 43.43,50.88 43.03,51.28 v41.98,51.28 | TP2.P$1 R1.1 | TP2.P$1 21.59,14.93 U1.8
  Bottom 0.254: v41.98,51.28 40.48,51.28 23.86,34.66 23.86,18.73 v22.32,17.19
SD_D2  (via drill 0.38 pad 0.74)
  Top 0.254: U2.P$51 v38.77,47.2 | U1.1 29.29,14.93 29.48,14.93 31.75,17.2 TP7.P$1 R8.1 32.58,19.47 32.58,19.9 v32.99,20.32
  Bottom 0.254: v32.99,20.32 35.93,23.25 35.93,42.45 38.77,45.29 v38.77,47.2
SD_D3  (via drill 0.38 pad 0.74)
  Top 0.254: 29.62,19.47 29.62,18.78 29.21,18.36 TP6.P$1 29.21,17.2 28.19,16.18 U1.2 | 29.62,19.47 30.04,19.47 30.11,19.54 v30.48,19.54 | R7.1 29.62,19.47 | U2.P$52 35.92,46.7 35.16,45.93 v35.16,42.95
  Bottom 0.254: v35.16,42.95 35.16,24.21 v30.48,19.54
SPI_MISO
  Top 0.254: U2.P$22 56.92,43.2 78.54,64.82 SV4.4
SPI_MOSI
  Top 0.254: SV4.5 78.54,67.36 54.88,43.7 U2.P$23
SPI_SCK
  Top 0.254: U2.P$21 49.76,42.7 58.96,42.7 78.54,62.28 SV4.3
SWDCLK  (via drill 0.38 pad 0.74)
  Top 0.254: v33.01,49.12 33.93,48.2 36.6,48.2 U2.P$49 | X1.4 5.01,52.96 5.12,52.84 v5.93,52.84
  Bottom 0.254: v5.93,52.84 30.19,52.84 33.01,50.02 v33.01,49.12
SWDIO  (via drill 0.38 pad 0.74)
  Top 0.254: v32.29,49.73 33.03,50.48 37.18,50.48 38.95,48.71 40.12,48.71 40.43,49.02 40.43,49.17 U2.P$46 | X1.2 v7.55,51.69
  Bottom 0.254: v7.55,51.69 30.33,51.69 v32.29,49.73
SWO  (via drill 0.38 pad 0.74)
  Top 0.254: U2.P$55 38.46,45.2 39.52,46.26 39.52,47.44 37.2,49.76 v33.78,49.76 | X1.6 v7.55,54.23
  Bottom 0.254: v33.78,49.76 33.78,50.02 29.58,54.23 v7.55,54.23
USB_5V  (via drill 0.38 pad 0.74)
  Top 0.254: U2.P$42 42.43,48.99 42.59,48.83 42.59,46.99 41.45,45.85 v41.11,45.85 | v41.11,45.85 | 55.5,12.05 54.61,12.94 v54.61,13.34 | 55.5,12.05 64.15,12.05 65.79,10.42 D4.A | 55.5,12.05 55.5,6.73 55.85,6.38 J1.1
  Bottom 0.254: v41.11,45.85 41.11,43.83 49.73,35.22 49.91,35.22 51.05,34.08 51.05,16.9 | 51.05,16.9 | 51.05,16.9 v54.61,13.34
USB_DM  (via drill 0.38 pad 0.74)
  Top 0.254: R10.2 56.39,10.87 56.2,11.06 v56.2,11.34 | v41.28,48.08 41.43,48.23 U2.P$44
  Bottom 0.254: v41.28,48.08 41.21,48.08 40.2,47.08 40.2,44.1 49.54,34.76 49.72,34.76 50.36,34.12 50.36,16.6 55.62,11.34 v56.2,11.34
USB_DP  (via drill 0.38 pad 0.74)
  Top 0.254: U2.P$45 40.93,48.72 40.59,48.37 40.59,47.15 v40.92,46.81 | R9.2 58.17,10.87 57.6,10.87 v57.15,11.34
  Bottom 0.254: v40.92,46.81 41.14,46.81 41.97,45.98 41.97,43.62 49.92,35.67 50.16,35.67 51.51,34.33 51.51,20.55 57.15,14.91 v57.15,11.34
USB_ID  (via drill 0.38 pad 0.74)
  Top 0.254: U2.P$43 41.93,48.42 42,48.35 42,47.43 v41.84,47.27 | v57.9,6.89 57.8,6.79 J1.4
  Bottom 0.254: v41.84,47.27 41.84,47.1 42.43,46.51 42.43,43.81 50.11,36.13 50.35,36.13 56.3,30.18 56.3,16.57 57.9,14.97 v57.9,6.89
USB_SHIELD
  Top 0.254: L3.1 62.05,5.73 61.48,5.16 J1.S4 59.22,5.16 59.22,4.4 | 53.95,4.31 58.39,4.31 58.45,4.37 | 53.95,4.31 53.95,4.03 53.4,3.48 J1.S1 | J1.S3 53.95,4.31 | 59.22,4.4 J1.S2 | 59.22,4.4 59.18,4.37 58.45,4.37 | J1.5 58.45,4.37
VBAT
  Top 0.254: D3.A 68.83,9.63 | JP1.1 70.59,6.35
  Top 0.406: 70.59,6.35 68.83,9.63
VDD  (via drill 0.38 pad 0.74)
  Top 0.254: 25.65,46.88 28.37,46.88 34.55,40.7 36.6,40.7 U2.P$64 | 22.28,23.37 21.84,22.94 21.59,22.94 TP8.P$1 R1.2 | TP10.P$1 22.28,23.37 | 22.28,23.37 22.28,23.54 21.5,24.32 C15.1 C16.1 10.23,27.18 | 75.55,41.41 75.78,41.65 MIC4.5 79.17,42.43 79.08,42.52 79.08,43.1 C22.1 79.92,44.77 78.54,46.16 78.54,57.2 SV4.1 | 75.6,23.02 81.5,23.02 82.33,23.85 82.33,31.61 75.55,38.39 75.55,41.41 | 75.55,41.41 75.26,41.7 U2.P$19 47.9,41.7 47.9,42.38 47.42,42.85 46.69,42.85 45.54,41.7 45.43,41.7 | 45.43,41.7 41.78,41.7 41.46,41.37 40.84,41.37 40.44,41.77 40.44,42.39 40.91,42.86 45.41,42.86 46.05,43.5 46.05,45.69 47.18,46.82 47.18,47.48 47.9,48.2 U2.P$32 50.08,48.2 50.22,48.35 C21.1 C23.1 | 75.6,23.02 75.6,23.16 R20.2 | 75.58,23.02 75.6,23.02 | 45.43,41.7 45.43,39.73 U2.P$13 | 43.55,3.56 43.55,3.55 MIC3.5 | 43.55,17.23 43.55,3.56 | 43.55,3.56 43.85,3.56 C20.1 | 43.55,17.23 38.24,22.53 33.94,22.53 32.58,21.17 R8.2 31.34,21.17 30.92,21.17 R7.2 R6.2 26.25,21.17 25.84,21.17 | 60.29,24.06 57.67,24.06 57.65,24.08 50.4,24.08 43.55,17.23 | 10.23,27.18 2.68,19.63 D1.A D2.A D5.A | 10.23,27.18 10.23,34.15 6.21,38.17 | 6.21,38.17 2.96,38.17 C18.1 | 6.93,38.89 6.21,38.17 | 6.93,38.89 7.36,38.89 12.25,43.77 12.25,46.88 | MIC2.5 6.14,39.68 6.93,38.89 | 8.63,50.94 2.09,50.94 1.93,51.1 1.93,57.28 2.6,57.94 26.54,57.94 31.08,53.41 R11.2 31.96,52.58 32.46,52.07 38.15,52.07 | 61.21,23.14 60.29,24.06 | 75.58,23.02 75.58,22.54 75.58,22.04 R19.2 75.58,17.21 78.61,14.17 SV2.1 | 8.63,50.94 X1.1 | 8.63,50.94 8.63,50.49 12.25,46.88 | 12.25,46.88 25.65,46.88 | 25.65,46.88 | 61.21,23.14 61.72,23.14 61.92,23.34 62.37,23.34 L1.2 64.63,23.34 64.77,23.2 65.72,23.2 66.13,23.2 C14.1 67.38,23.2 67.56,23.02 75.58,23.02
  Top 0.254: 61.21,23.14 | 61.21,23.14 IC2.8 60.16,22.82 60.16,22.09 58.94,20.87 58.59,20.87 | C13.1 60.29,24.06 | U1.4 25.99,14.93 25.99,18.51 25.84,18.66 25.84,21.17 | C10.1 56.46,19.9 56.84,19.52 v57.01,19.52 | IC2.4 58.59,20.87 | 58.59,20.87 58.59,19.12 R13.2 | U2.P$48 39.43,51.03 39.24,51.03 39.03,51.24 C17.1 38.15,52.07 | 39.44,78.57 39.44,79.94 41.19,81.69 58.21,81.69 59.14,80.76 SV1.5 59.14,76.83 59.25,76.72 C7.1 59.25,74.49 59.27,74.47 C6.1 | MIC1.5 40.17,77.8 40.17,77.84 39.44,78.57 | 39.44,78.57 C8.1 37.78,78.57 37.67,78.68 37.67,78.74 37.38,78.74 TP11.P$1 36.5,78.74 34.84,80.4 23.73,80.4 22.96,79.64 22.96,77.5 21.41,75.95 C24.1 11.72,78.54 SV3.1 | R1.2 22.42,21.17 23.3,21.17 R2.2 25.84,21.17 | R1.2 20.39,21.17 C9.1 | 38.15,52.07 38.15,52.39 39.03,53.27 C19.1 | SJ1.2 25.65,46.88
  Bottom 0.254: SV4.1 78.54,57.2 62.95,72.79 62.95,79.98 62.16,80.78 61.01,80.78 SV1.5 | SV2.1 62.35,14.17 v57.01,19.52

### Text on the board
tNames: 07022017 | ARM / SWD | RESET | SHUMBA | BASE | acacia | R | G | B
bNames: LORA | GPS | PPS | VDD | TX | RX | GND | EN | VDD | PB15 | PB9 | TX | RX | GND | GND | SPI_MOSI | SPI_MISO | SPI_SCK | PB9 | VDD | GND | I2C_SCL | I2C_SDA | PB14 | PB13 | VDD